# EAGLE schematic ir_module (EAGLE 6.1)
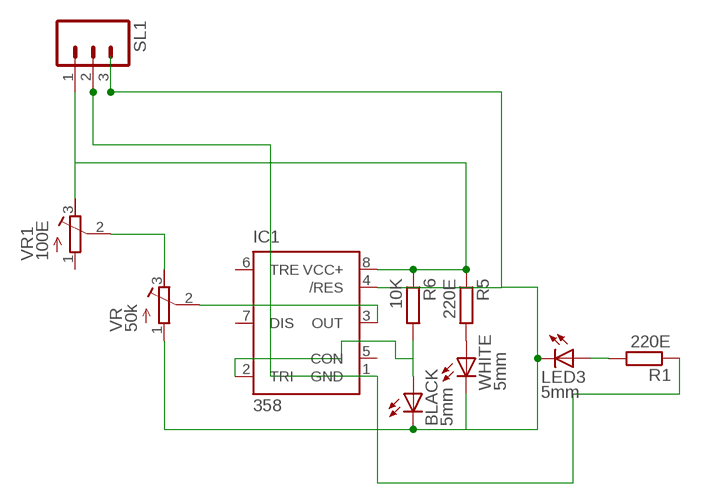
[diagram p0: schematic, sheet 1]

## Parts
BLACK  5mm  LED5MM  [LED5MM]
IC1  358  NE555  [DIL-08]
LED3  5mm  LED5MM  [LED5MM]
R1  220E  R-EU_0204/7  [0204/7]
R5  220E  R-EU_0204/7  [0204/7]
R6  10K  R-EU_0204/7  [0204/7]
SL1  M03  [03P]
VR  50k  R-TRIMM64P  [RTRIM64P]
VR1  100E  R-TRIMM64P  [RTRIM64P]
WHITE  5mm  LED5MM  [LED5MM]

## Nets
N$2: IC1.8(VCC+) R5.1 R6.1 SL1.1 VR1.3(A)
N$3: IC1.1(GND) R1.1 SL1.2
N$4: LED3.A R1.2
N$5: R5.2 WHITE.A
N$6: IC1.3(OUT) VR.2(S)
N$9: BLACK.A IC1.2(TRI) R6.2
N$10: VR1.2(S) VR.3(A)
N$11: BLACK.K(C) IC1.4(/RES) LED3.K(C) SL1.3 VR.1(E) WHITE.K(C)
Unconnected: IC1.5(CON) IC1.6(TRE) IC1.7(DIS) VR1.1(E)

## Library data of the parts
BLACK LED3 WHITE = led:LED: LED OSRAM: - CHIPLED LG R971, LG N971, LY N971, LG Q971, LY Q971, LO R971, LY R971 LH N974, LH R974 LS Q976, LO Q976, LY Q976 LO Q996 - Hyper CHIPLED LW Q18S LB Q993, LB Q99A, LB R99A - SideLED LS A670, LO A670, LY A670, LG A670, LP A670 LB A673, LV A673, LT A673, LW A673 LH A674 LY A675 LS A676, LA A676, LO A676, LY A676, LW A676 LS A679, LY A679, LG A679 - Hyper Micro SIDELED® LS Y876, LA Y876, LO Y876, LY Y876 LT Y87S - SmartLED LW L88C, LW L88S LB L89C, LB L89S, LG L890 LS L89K, LO L89K, LY L89K LS L896, LA L896, LO L896, LY L896 - TOPLED LS T670, LO T670, LY T670, LG T670, LP T670 LSG T670, LSP T670, LSY T670, LOP T670, LYG T670 LG T671, LOG T671, LSG T671 LB T673, LV T673, LT T673, LW T673 LH T674 LS T676, LA T676, LO T676, LY T676, LB T676, LH T676, LSB T676, LW T676 LB T67C, LV T67C, LT T67C, LS T67K, LO T67K, LY T67K, LW E67C LS E67B, LA E67B, LO E67B, LY E67B, LB E67C, LV E67C, LT E67C LW T67C LS T679, LY T679, LG T679 LS T770, LO T770, LY T770, LG T770, LP T770 LB T773, LV T773, LT T773, LW T773 LH T774 LS E675, LA E675, LY E675, LS T675 LS T776, LA T776, LO T776, LY T776, LB T776 LHGB T686 LT T68C, LB T68C - Hyper Mini TOPLED® LB M676 - Mini TOPLED Santana® LG M470 LS M47K, LO M47K, LY M47K Source: http://www.osram.convergy.de LUXEON: - LUMILED® LXK2-PW12-R00, LXK2-PW12-S00, LXK2-PW14-U00, LXK2-PW14-V00 LXK2-PM12-R00, LXK2-PM12-S00, LXK2-PM14-U00 LXK2-PE12-Q00, LXK2-PE12-R00, LXK2-PE12-S00, LXK2-PE14-T00, LXK2-PE14-U00 LXK2-PB12-K00, LXK2-PB12-L00, LXK2-PB12-M00, LXK2-PB14-N00, LXK2-PB14-P00, LXK2-PB14-Q00 LXK2-PR12-L00, LXK2-PR12-M00, LXK2-PR14-Q00, LXK2-PR14-R00 LXK2-PD12-Q00, LXK2-PD12-R00, LXK2-PD12-S00 LXK2-PH12-R00, LXK2-PH12-S00 LXK2-PL12-P00, LXK2-PL12-Q00, LXK2-PL12-R00 Source: www.luxeon.com KINGBRIGHT: KA-3528ASYC Source: www.kingbright.com
IC1 = st-microelectronics:NE555: General purpose bipolar Timer; MF: Arrow Electronics; MPN: NE555N; OC_FARNELL: 1467742; OC_NEWARK: 89K1486
R1 R5 R6 = rcl:R-EU_: RESISTOR, European symbol
SL1 = con-amp-quick:M03: AMP QUICK CONNECTOR; OC_FARNELL: unknown; OC_NEWARK: unknown
VR VR1 = resistor:R-TRIMM: Trimm resistor